# EAGLE design RS232_ACPL_827 (EAGLE 7.2.0)
RS232 Adapter using ACPL-827 Optocouplers Powered by PIC
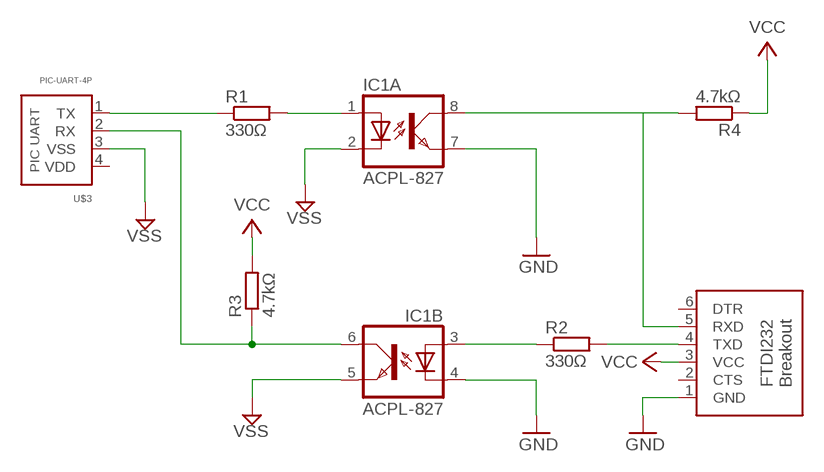
[diagram p0: schematic, sheet 1]

## Parts
IC1  ACPL-827  [DIL08]
R1  330Ω  R-EU_0207/10  [0207/10]
R2  330Ω  R-EU_0204/7  [0204/7]
R3  4.7kΩ  R-EU_0204/7  [0204/7]
R4  4.7kΩ  R-EU_0204/7  [0204/7]
U$2  FTDI232-BO-6P  [CONN-6P]
U$3  PIC-UART-4P  [CONN-4P]

## Nets
GND: IC1.4(B:C) IC1.7(A:EMIT) U$2.1(GND)
N$1: IC1.1(A:A) R1.2
N$2: R1.1 U$3.1(TX)
N$3: IC1.3(B:A) R2.1
N$4: R2.2 U$2.4(TXD)
N$5: IC1.6(B:COL) R3.1 U$3.2(RX)
N$6: IC1.8(A:COL) R4.2 U$2.5(RXD)
VCC: R3.2 R4.1 U$2.3(VCC)
VSS: IC1.2(A:C) IC1.5(B:EMIT) U$3.3(VSS)
Unconnected: U$2.2(CTS) U$2.6(DTR) U$3.4(VDD)

## Library data of the parts
IC1 = opto-c:ACPL-827
R1-R4 = resistor:R-EU_: RESISTOR, European symbol
U$2 = pinconn:FTDI232-BO: Pin connectors
U$3 = pinconn:PIC-UART

## Board
RS232 Adapter using ACPL-827 Optocouplers Powered by PIC
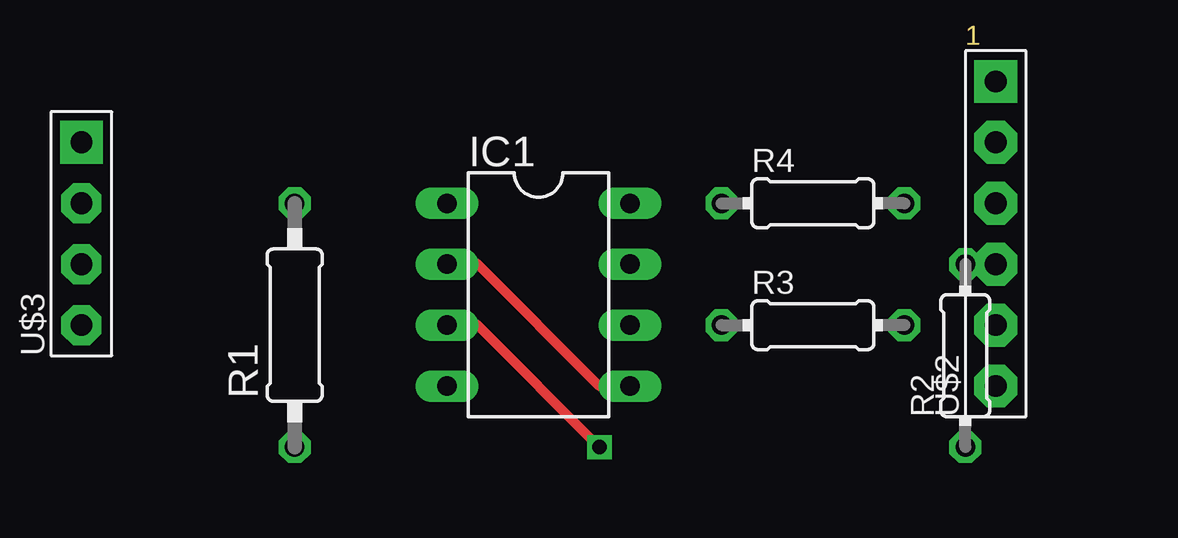
[diagram p1: board, top side]
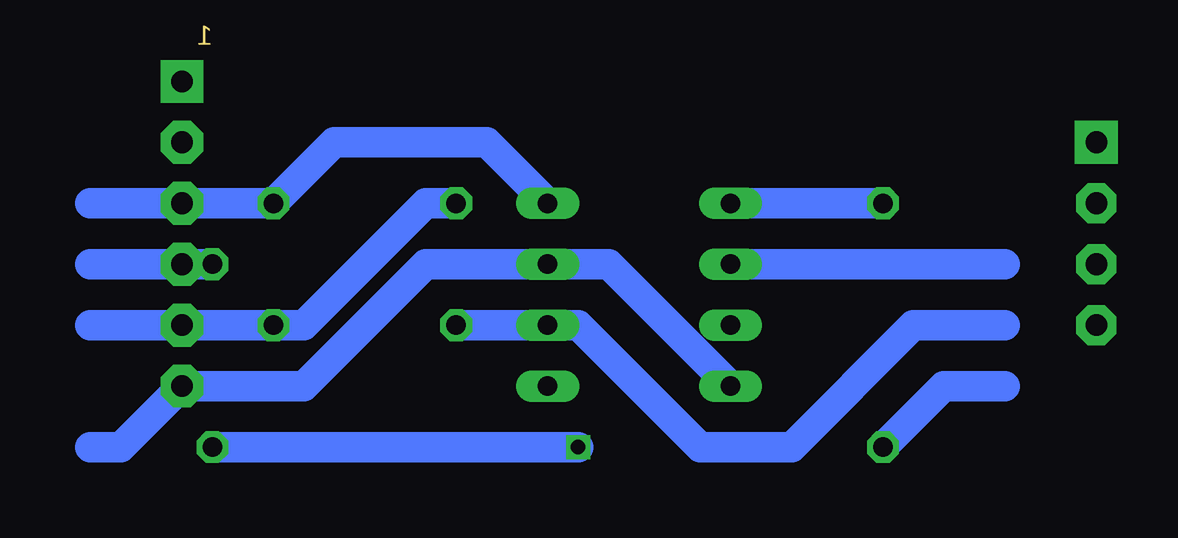
[diagram p2: board, bottom side, seen from below]

No outline drawn. Coordinates in mm, seen from the top.
Copper layers (1*16): Top 0.035mm / dielectric 1.5mm / Bottom 0.035mm
Design rules "default": minimum track width 10mil, minimum drill 24mil, track to track 8mil, track to pad 8mil, pad to pad 8mil, via to via 8mil, smd to smd 8mil, copper to edge 40mil, drill to drill 8mil, minimum pad ring 10mil, minimum via ring 8mil, stop-mask expansion 4mil, vias tented up to drill 0mil, thermal gap 10mil

### Footprints (pad centres in the part's own frame; a part is rotated, then mirrored left to right if it is on the bottom)
DIL08 = drill 0.813 long: 1 -3.81,-3.81; 2 -1.27,-3.81; 3 1.27,-3.81; 4 3.81,-3.81; 5 3.81,3.81; 6 1.27,3.81; 7 -1.27,3.81; 8 -3.81,3.81
0207/10 = drill 0.813 octagon: 1 -5.08,0; 2 5.08,0
0204/7 = drill 0.813 octagon: 1 -3.81,0; 2 3.81,0
CONN-6P = drill 0.9 pad 1.778 square: 1 0,0 | drill 0.9 pad 1.778 octagon: 2 2.54,0; 3 5.08,0; 4 7.62,0; 5 10.16,0; 6 12.7,0
CONN-4P = drill 0.9 pad 1.778 square: 1 0,0 | drill 0.9 pad 1.676 octagon: 2 2.54,0; 3 5.08,0; 4 7.62,0

### Placement (x,y rotation side)
IC1  17.78,8.89 270 top
R1  7.62,7.62 90 top
R2  35.56,6.35 90 top
R3  29.21,7.62 0 top
R4  29.21,12.7 0 top
U$2  36.83,17.78 270 top
U$3  -1.27,15.24 270 top

### Tracks (layer width: path | path; a pad name or v marks a point on that pad's centre or on a via)
GND
  Bottom 1.27: 40.64,2.54 39.37,2.54 36.83,5.08 31.75,5.08 26.67,10.16 IC1.7 19.05,10.16 IC1.4
N$1
  Bottom 1.27: IC1.1 R1.2
N$2
  Bottom 1.27: 2.54,5.08 5.08,5.08 R1.1
N$3  (via drill 0.6)
  Top 0.406: IC1.3 15.24,7.62 v20.32,2.54
  Bottom 1.27: v20.32,2.54 R2.1
N$4
  Bottom 1.27: 40.64,10.16 R2.2
N$5
  Bottom 1.27: R3.1 IC1.6 20.32,7.62 15.24,2.54 11.43,2.54 6.35,7.62 2.54,7.62
N$6
  Bottom 1.27: 40.64,12.7 R4.2 30.48,15.24 24.13,15.24 IC1.8
VCC
  Bottom 1.27: R4.1 26.67,12.7 31.75,7.62 R3.2 40.64,7.62
VSS
  Top 0.406: IC1.5 20.32,5.08 15.24,10.16 IC1.2
  Bottom 1.27: IC1.2 2.54,10.16